# EAGLE design zeta2rework_lw_v5 (EAGLE 9.0.1)
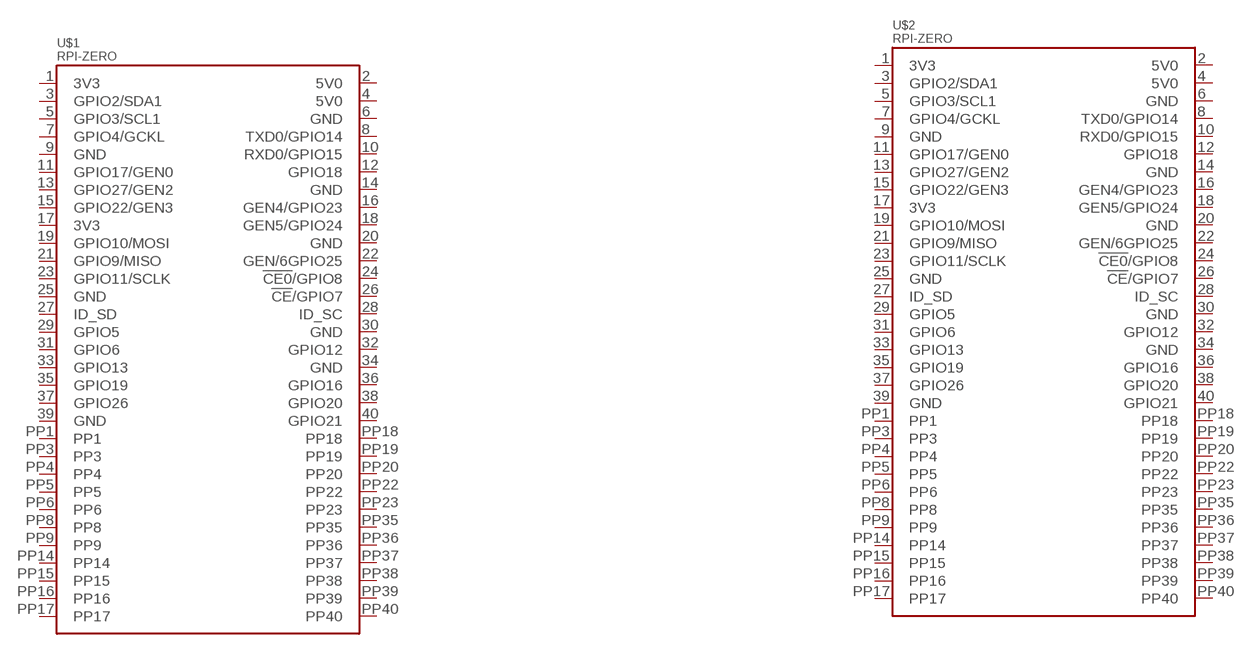
[diagram p0: schematic, sheet 1, part 1 of 2]
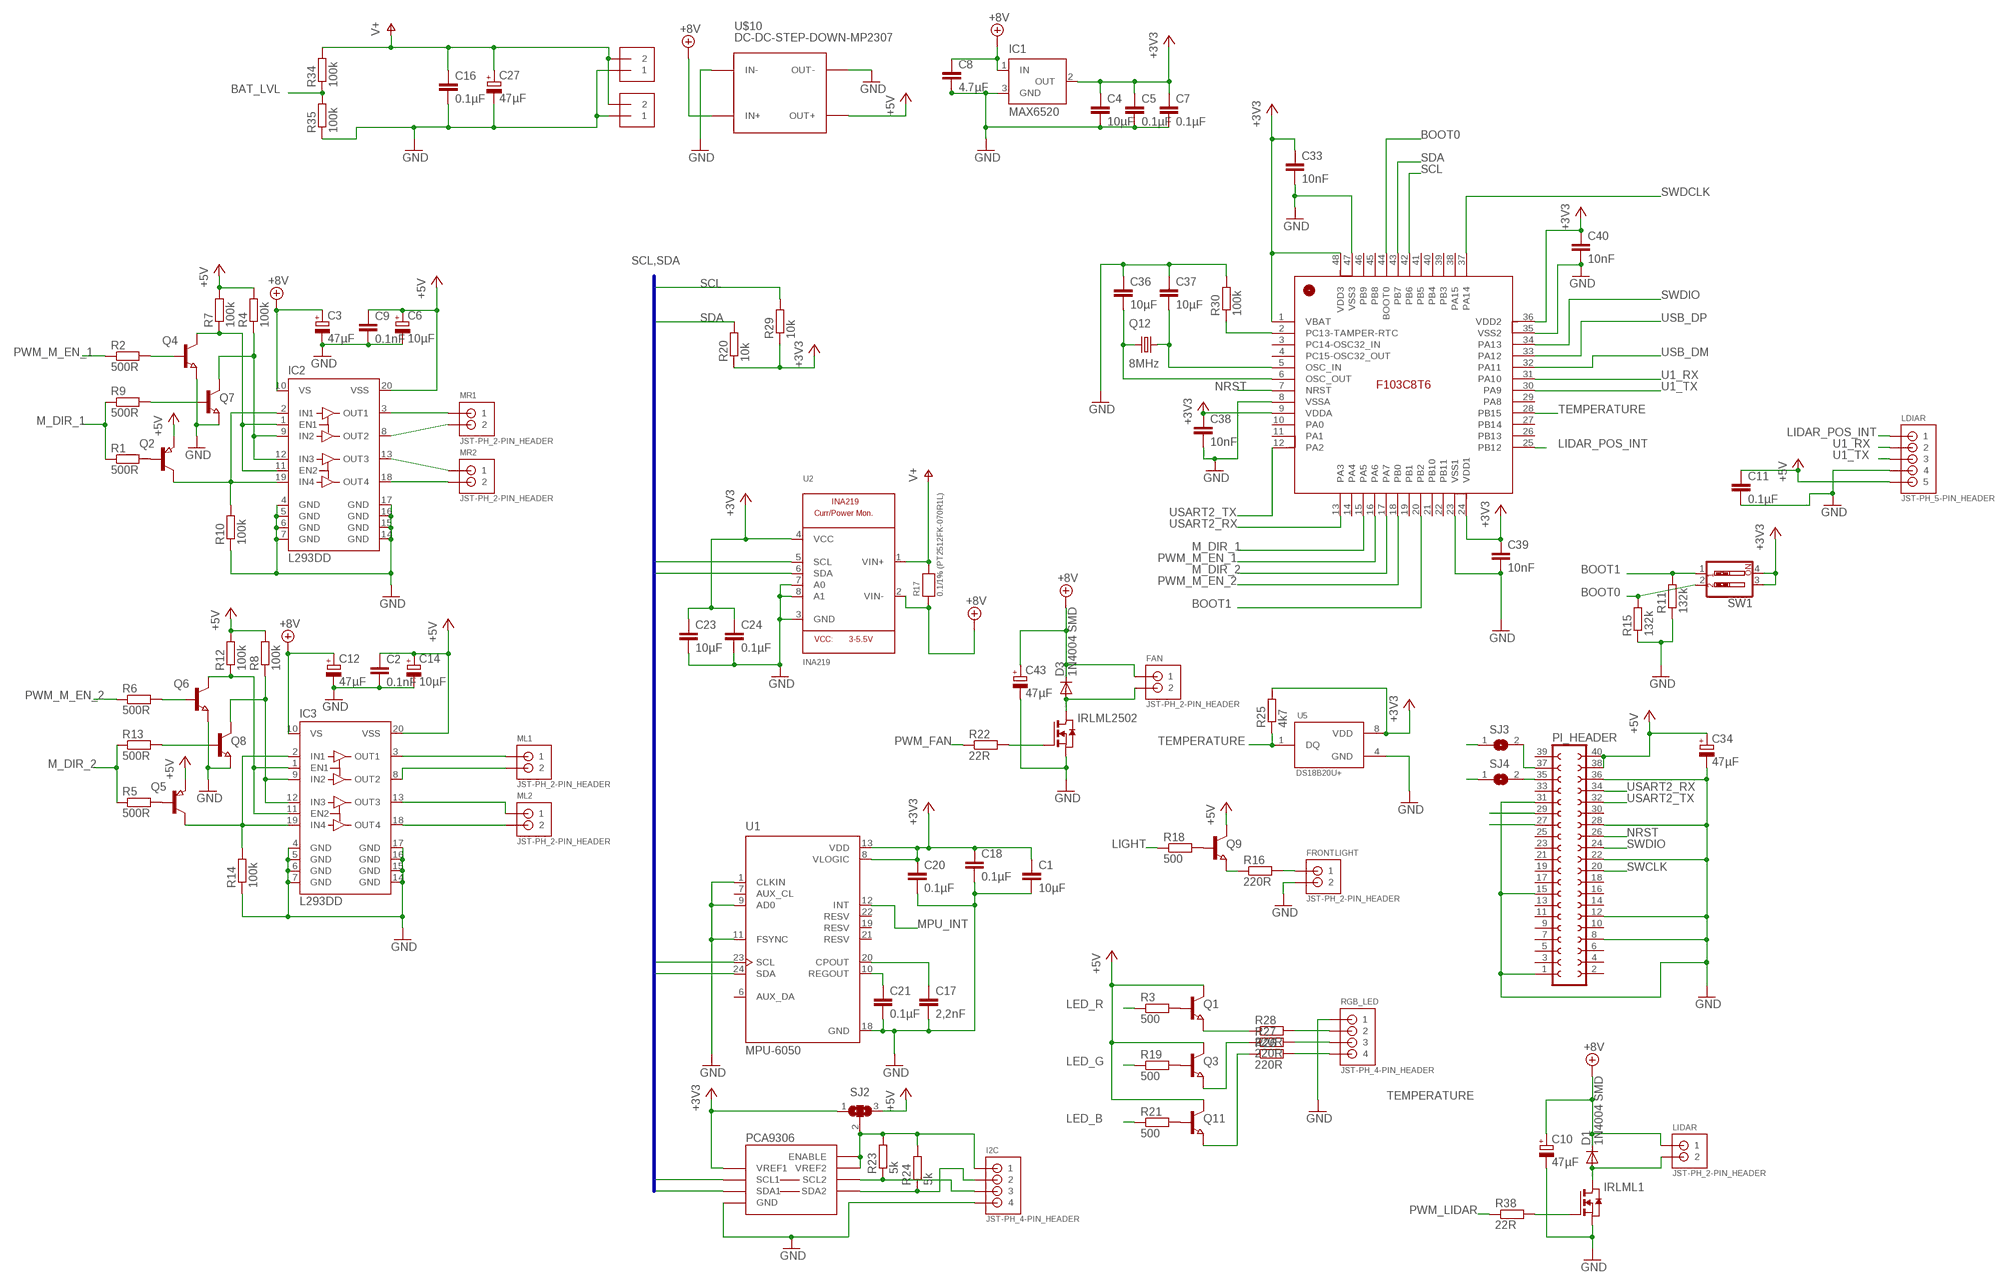
[diagram p1: schematic, sheet 1, part 2 of 2]

## Parts
C1  10µF  C-EUC1206  [C1206]
C2  0.1nF  C-EUC1206  [C1206]
C3  47µF  CPOL-EUUD-4X5,8  [UD-4X5,8_NICHICON]
C4  10µF  C-EUC1206  [C1206]
C5  0.1µF  C-EUC1206  [C1206]
C6  10µF  CPOL-EUUD-4X5,8  [UD-4X5,8_NICHICON]
C7  0.1µF  C-EUC1206  [C1206]
C8  4.7µF  C-EUC1206  [C1206]
C9  0.1nF  C-EUC1206  [C1206]
C10  47µF  CPOL-EUUD-4X5,8  [UD-4X5,8_NICHICON]
C11  0.1µF  C-EUC1206  [C1206]
C12  47µF  CPOL-EUUD-4X5,8  [UD-4X5,8_NICHICON]
C14  10µF  CPOL-EUUD-4X5,8  [UD-4X5,8_NICHICON]
C16  0.1µF  C-EUC1206  [C1206]
C17  2,2nF  C-EUC1206  [C1206]
C18  0.1µF  C-EUC1206  [C1206]
C20  0.1µF  C-EUC1206  [C1206]
C21  0.1µF  C-EUC1206  [C1206]
C23  10µF  C-EUC1206  [C1206]
C24  0.1µF  C-EUC1206  [C1206]
C27  47µF  CPOL-EUUD-4X5,8  [UD-4X5,8_NICHICON]
C33  10nF  C-EUC1206  [C1206]
C34  47µF  CPOL-EUUD-4X5,8  [UD-4X5,8_NICHICON]
C36  10µF  C-EUC1206  [C1206]
C37  10µF  C-EUC1206  [C1206]
C38  10nF  C-EUC1206  [C1206]
C39  10nF  C-EUC1206  [C1206]
C40  10nF  C-EUC1206  [C1206]
C43  47µF  CPOL-EUUD-4X5,8  [UD-4X5,8_NICHICON]
D1  1N4004 SMD  DIODE-DO214AC  [DO214AC]
D3  1N4004 SMD  DIODE-DO214AC  [DO214AC]
FAN  JST-PH_2-PIN_HEADER  [JST_B2B-PH_HEADER]
FRONTLIGHT  JST-PH_2-PIN_HEADER  [JST_B2B-PH_HEADER]
I2C  JST-PH_4-PIN_HEADER  [JST_B4B-PH_HEADER]
IC1  MAX6520  [SOT23]
IC2  L293DD  [SO20]
IC3  L293DD  [SO20]
IRLML1  NMOSSOT23  [SOT-23]
IRLML2502  NMOSSOT23  [SOT-23]
LDIAR  JST-PH_5-PIN_HEADER  [JST_B5B-PH_HEADER]
LIDAR  JST-PH_2-PIN_HEADER  [JST_B2B-PH_HEADER]
ML1  JST-PH_2-PIN_HEADER  [JST_B2B-PH_HEADER]
ML2  JST-PH_2-PIN_HEADER  [JST_B2B-PH_HEADER]
MR1  JST-PH_2-PIN_HEADER  [JST_B2B-PH_HEADER]
MR2  JST-PH_2-PIN_HEADER  [JST_B2B-PH_HEADER]
PCA9306  IC2_LEVEL_TRANSLATER  [SOIC-8]
PI_HEADER  FE20-2  [FE20-2]
Q1  NPN-TRANSISTOR_SOT23  [SOT23]
Q2  PNP-TRANSISTOR_SOT23  [SOT23]
Q3  NPN-TRANSISTOR_SOT23  [SOT23]
Q4  NPN-TRANSISTOR_SOT23  [SOT23]
Q5  PNP-TRANSISTOR_SOT23  [SOT23]
Q6  NPN-TRANSISTOR_SOT23  [SOT23]
Q7  NPN-TRANSISTOR_SOT23  [SOT23]
Q8  NPN-TRANSISTOR_SOT23  [SOT23]
Q9  NPN-TRANSISTOR_SOT23  [SOT23]
Q11  NPN-TRANSISTOR_SOT23  [SOT23]
Q12  8MHz  KX-13  [7.0X5.0]
R1  500R  R-EU_R0603  [R0603]
R2  500R  R-EU_R0603  [R0603]
R3  500  R-EU_R0603  [R0603]
R4  100k  R-EU_R0603  [R0603]
R5  500R  R-EU_R0603  [R0603]
R6  500R  R-EU_R0603  [R0603]
R7  100k  R-EU_R0603  [R0603]
R8  100k  R-EU_R0603  [R0603]
R9  500R  R-EU_R0603  [R0603]
R10  100k  R-EU_R0603  [R0603]
R11  132k  R-EU_R0603  [R0603]
R12  100k  R-EU_R0603  [R0603]
R13  500R  R-EU_R0603  [R0603]
R14  100k  R-EU_R0603  [R0603]
R15  132k  R-EU_R0603  [R0603]
R16  220R  R-EU_R0603  [R0603]
R17  0.1/1% (PT2512FK-070R1L)  RESISTOR2512  [2512]
R18  500  R-EU_R1206  [R1206]
R19  500  R-EU_R0603  [R0603]
R20  10k  R-EU_R0603  [R0603]
R21  500  R-EU_R0603  [R0603]
R22  22R  R-EU_R0603  [R0603]
R23  5k  R-EU_R0603  [R0603]
R24  5k  R-EU_R0603  [R0603]
R25  4k7  R-EU_R0603  [R0603]
R26  220R  R-EU_R0603  [R0603]
R27  220R  R-EU_R0603  [R0603]
R28  220R  R-EU_R0603  [R0603]
R29  10k  R-EU_R0603  [R0603]
R30  100k  R-EU_R0603  [R0603]
R34  100k  R-EU_R0603  [R0603]
R35  100k  R-EU_R0603  [R0603]
R38  22R  R-EU_R0603  [R0603]
RGB_LED  JST-PH_4-PIN_HEADER  [JST_B4B-PH_HEADER]
SJ2  SJ2W  [SJ_2]
SJ3  SOLDERJUMPERREFLOW_NOPASTE  [SOLDERJUMPER_REFLOW_NOPASTE]
SJ4  SOLDERJUMPERREFLOW_NOPASTE  [SOLDERJUMPER_REFLOW_NOPASTE]
STM32F103CB  STM32F103CB  STM32F103C8T6  [LQFP48_7X7MM_0.5MMPP]
SUPPLY_IN  TERMBLOCK_1X2-3.5MM  [1X2-3.5MM]
SUPPLY_IN1  TERMBLOCK_1X2-3.5MM  [1X2-3.5MM]
SW1  SW_DIP-2  [EDG-02]
U1  MPU-6050  [QFN50P400X400X95-24N]
U2  INA219  [SOT23-8]
U5  DS18B20U+  [SOP65P490X95-8N]
U$1  RPI-ZERO  [RASP_PI_ZERO_BOARD_FULL]
U$2  RPI-ZERO  [RASP_PI_ZERO_BOARD_FULL]
U$10  DC-DC-STEP-DOWN-MP2307  [DC-DC-STEP-DOWN-MP2307]

## Nets
+3V3: C1.1 C4.1 C5.1 C7.1 C18.1 C20.1 C23.1 C24.1 C33.1 C38.1 C39.1 C40.1 IC1.2(OUT) PCA9306.1(VREF1) R20.1 R25.2 R29.1 SJ2.1 STM32F103CB.1(VBAT) STM32F103CB.9(VDDA) STM32F103CB.24(VDD1) STM32F103CB.36(VDD2) STM32F103CB.48(VDD3) SW1.3 SW1.4 U1.8(VLOGIC) U1.13(VDD) U2.4(VCC) U5.8(VDD)
+5V: C2.1 C6.+ C9.1 C11.1 C14.+ C34.+ IC2.20(VSS) IC3.20(VSS) LDIAR.P5 PI_HEADER.38 PI_HEADER.40 Q1.3(C) Q2.2(E) Q3.3(C) Q5.2(E) Q9.3(C) Q11.3(C) R4.2 R7.2 R8.2 R12.2 SJ2.3 U$10.OUT+
+8V: C3.+ C8.1 C10.+ C12.+ C43.+ D1.C D3.C FAN.P1 IC1.1(IN) IC2.10(VS) IC3.10(VS) LIDAR.P1 R17.1 U2.2(VIN-) U$10.IN+
BAT_LVL: R34.1 R35.2
BOOT0: R15.2 STM32F103CB.44(BOOT0) SW1.2
BOOT1: R11.2 STM32F103CB.20(PB2) SW1.1
BOOT2: PI_HEADER.29
BOOT3: PI_HEADER.27
GND: C1.2 C2.2 C3.- C4.2 C5.2 C6.- C7.2 C8.2 C9.2 C10.- C11.2 C12.- C14.- C16.2 C17.2 C18.2 C20.2 C21.2 C23.2 C24.2 C27.- C33.2 C34.- C36.1 C37.1 C38.2 C39.2 C40.2 C43.- FRONTLIGHT.P2 I2C.P4 IC1.3(GND) IC2.4(GND) IC2.5(GND) IC2.6(GND) IC2.7(GND) IC2.14(GND) IC2.15(GND) IC2.16(GND) IC2.17(GND) IC3.4(GND) IC3.5(GND) IC3.6(GND) IC3.7(GND) IC3.14(GND) IC3.15(GND) IC3.16(GND) IC3.17(GND) IRLML1.2(S) IRLML2502.2(S) LDIAR.P4 PCA9306.4(GND) PI_HEADER.1 PI_HEADER.8 PI_HEADER.12 PI_HEADER.15 PI_HEADER.22 PI_HEADER.28 PI_HEADER.31 PI_HEADER.36 Q4.2(E) Q6.2(E) Q7.2(E) Q8.2(E) R10.1 R11.1 R14.1 R15.1 R30.2 R35.1 RGB_LED.P1 STM32F103CB.8(VSSA) STM32F103CB.23(VSS1) STM32F103CB.35(VSS2) STM32F103CB.47(VSS3) SUPPLY_IN1.1 SUPPLY_IN.1 U1.1(CLKIN) U1.9(AD0) U1.11(FSYNC) U1.18(GND) U2.3(GND) U2.7(A0) U2.8(A1) U5.4(GND) U$10.IN- U$10.OUT-
LED_B: R21.1
LED_G: R19.1
LED_R: R3.1
LIDAR_POS_INT: LDIAR.P1 STM32F103CB.25(PB12)
LIGHT: R18.1
M_DIR_1: R1.1 R9.1 STM32F103CB.15(PA5)
M_DIR_2: R5.1 R13.1 STM32F103CB.17(PA7)
MPU_INT: U1.12(INT)
N$1: IC2.9(IN2) IC2.12(IN3) Q7.3(C) R4.1
N$2: IC3.18(OUT4) ML2.P2
N$3: IC3.13(OUT3) ML2.P1
N$4: IC2.18(OUT4) MR2.P2
N$5: IC2.2(IN1) IC2.19(IN4) Q2.3(C) R10.2
N$6: IC3.9(IN2) IC3.12(IN3) Q8.3(C) R8.1
N$7: IC3.2(IN1) IC3.19(IN4) Q5.3(C) R14.2
N$8: IC2.1(EN1) IC2.11(EN2) Q4.3(C) R7.1
N$9: IC3.1(EN1) IC3.11(EN2) Q6.3(C) R12.1
N$10: Q2.1(B) R1.2
N$11: Q4.1(B) R2.2
N$12: Q7.1(B) R9.2
N$13: Q5.1(B) R5.2
N$14: Q6.1(B) R6.2
N$15: Q8.1(B) R13.2
N$16: IC2.13(OUT3) MR2.P1
N$17: IC2.8(OUT2) MR1.P2
N$18: IC2.3(OUT1) MR1.P1
N$19: Q9.1(B) R18.2
N$20: Q9.2(E) R16.1
N$21: FRONTLIGHT.P1 R16.2
N$22: Q1.1(B) R3.2
N$23: Q3.1(B) R19.2
N$24: Q1.2(E) R28.1
N$25: IC3.8(OUT2) ML1.P2
N$26: IC3.3(OUT1) ML1.P1
N$28: Q3.2(E) R27.1
N$30: Q11.2(E) R26.1
N$31: R26.2 RGB_LED.P4
N$32: Q11.1(B) R21.2
N$33: R27.2 RGB_LED.P3
N$34: C17.1 U1.20(CPOUT)
N$35: R28.2 RGB_LED.P2
N$36: C21.1 U1.10(REGOUT)
N$37: IRLML2502.3(G) R22.2
N$38: IRLML1.3(G) R38.2
N$39: D1.A IRLML1.1(D) LIDAR.P2
N$41: I2C.P1 PCA9306.7(VREF2) PCA9306.8(ENABLE) R23.2 R24.2 SJ2.2
N$42: I2C.P3 PCA9306.6(SCL2) R23.1
N$43: I2C.P2 PCA9306.5(SDA2) R24.1
N$44: PI_HEADER.37 SJ3.2
N$45: PI_HEADER.35 SJ4.2
N$46: C36.2 Q12.1 STM32F103CB.6(OSC_OUT)
N$47: C37.2 Q12.3 STM32F103CB.5(OSC_IN)
N$49: R30.1 STM32F103CB.2(PC13-TAMPER-RTC)
N$55: D3.A FAN.P2 IRLML2502.1(D)
NRST: PI_HEADER.26 STM32F103CB.7(NRST)
PWM_FAN: R22.1
PWM_LIDAR: R38.1
PWM_M_EN_1: R2.1 STM32F103CB.16(PA6)
PWM_M_EN_2: R6.1 STM32F103CB.18(PB0)
SCL: R29.2 STM32F103CB.42(PB6) U1.23(SCL) U2.5(SCL)
SCL2: PCA9306.2(SCL1)
SCL3: SJ4.1
SDA: R20.2 STM32F103CB.43(PB7) U1.24(SDA) U2.6(SDA)
SDA2: PCA9306.3(SDA1)
SDA3: SJ3.1
SWCLK: PI_HEADER.20
SWDCLK: STM32F103CB.37(PA14)
SWDIO: PI_HEADER.24 STM32F103CB.34(PA13)
TEMPERATURE: R25.1 STM32F103CB.28(PB15) U5.1(DQ)
U1_RX: LDIAR.P2 STM32F103CB.31(PA10)
U1_TX: LDIAR.P3 STM32F103CB.30(PA9)
USART2_RX: PI_HEADER.34 STM32F103CB.13(PA3)
USART2_TX: PI_HEADER.32 STM32F103CB.12(PA2)
USB_DM: STM32F103CB.32(PA11)
USB_DP: STM32F103CB.33(PA12)
V+: C16.1 C27.+ R17.2 R34.2 SUPPLY_IN1.2 SUPPLY_IN.2 U2.1(VIN+)
Unconnected: PI_HEADER.2 PI_HEADER.3 PI_HEADER.4 PI_HEADER.5 PI_HEADER.6 PI_HEADER.7 PI_HEADER.9 PI_HEADER.10 PI_HEADER.11 PI_HEADER.13 PI_HEADER.14 PI_HEADER.16 PI_HEADER.17 PI_HEADER.18 PI_HEADER.19 PI_HEADER.21 PI_HEADER.23 PI_HEADER.25 PI_HEADER.30 PI_HEADER.33 PI_HEADER.39 STM32F103CB.3(PC14-OSC32_IN) STM32F103CB.4(PC15-OSC32_OUT) STM32F103CB.10(PA0) STM32F103CB.11(PA1) STM32F103CB.14(PA4) STM32F103CB.19(PB1) STM32F103CB.21(PB10) STM32F103CB.22(PB11) STM32F103CB.26(PB13) STM32F103CB.27(PB14) STM32F103CB.29(PA8) STM32F103CB.38(PA15) STM32F103CB.39(PB3) STM32F103CB.40(PB4) STM32F103CB.41(PB5) STM32F103CB.45(PB8) STM32F103CB.46(PB9) U1.6(AUX_DA) U1.7(AUX_CL) U1.19(RESV) U1.21(RESV) U1.22(RESV) U$1.1(3V3) U$1.2(5V0) U$1.3(GPIO2/SDA1) U$1.4(5V0) U$1.5(GPIO3/SCL1) U$1.6(GND) U$1.7(GPIO4/GCKL) U$1.8(TXD0/GPIO14) U$1.9(GND) U$1.10(RXD0/GPIO15) U$1.11(GPIO17/GEN0) U$1.12(GPIO18) U$1.13(GPIO27/GEN2) U$1.14(GND) U$1.15(GPIO22/GEN3) U$1.16(GEN4/GPIO23) U$1.17(3V3) U$1.18(GEN5/GPIO24) U$1.19(GPIO10/MOSI) U$1.20(GND) U$1.21(GPIO9/MISO) U$1.22(GEN/6GPIO25) U$1.23(GPIO11/SCLK) U$1.24(!CE0!/GPIO8) U$1.25(GND) U$1.26(!CE!/GPIO7) U$1.27(ID_SD) U$1.28(ID_SC) U$1.29(GPIO5) U$1.30(GND) U$1.31(GPIO6) U$1.32(GPIO12) U$1.33(GPIO13) U$1.34(GND) U$1.35(GPIO19) U$1.36(GPIO16) U$1.37(GPIO26) U$1.38(GPIO20) U$1.39(GND) U$1.40(GPIO21) U$1.PP1 U$1.PP3 U$1.PP4 U$1.PP5 U$1.PP6 U$1.PP8 U$1.PP9 U$1.PP14 U$1.PP15 U$1.PP16 U$1.PP17 U$1.PP18 U$1.PP19 U$1.PP20 U$1.PP22 U$1.PP23 U$1.PP35 U$1.PP36 U$1.PP37 U$1.PP38 U$1.PP39 U$1.PP40 U$2.1(3V3) U$2.2(5V0) U$2.3(GPIO2/SDA1) U$2.4(5V0) U$2.5(GPIO3/SCL1) U$2.6(GND) U$2.7(GPIO4/GCKL) U$2.8(TXD0/GPIO14) U$2.9(GND) U$2.10(RXD0/GPIO15) U$2.11(GPIO17/GEN0) U$2.12(GPIO18) U$2.13(GPIO27/GEN2) U$2.14(GND) U$2.15(GPIO22/GEN3) U$2.16(GEN4/GPIO23) U$2.17(3V3) U$2.18(GEN5/GPIO24) U$2.19(GPIO10/MOSI) U$2.20(GND) U$2.21(GPIO9/MISO) U$2.22(GEN/6GPIO25) U$2.23(GPIO11/SCLK) U$2.24(!CE0!/GPIO8) U$2.25(GND) U$2.26(!CE!/GPIO7) U$2.27(ID_SD) U$2.28(ID_SC) U$2.29(GPIO5) U$2.30(GND) U$2.31(GPIO6) U$2.32(GPIO12) U$2.33(GPIO13) U$2.34(GND) U$2.35(GPIO19) U$2.36(GPIO16) U$2.37(GPIO26) U$2.38(GPIO20) U$2.39(GND) U$2.40(GPIO21) U$2.PP1 U$2.PP3 U$2.PP4 U$2.PP5 U$2.PP6 U$2.PP8 U$2.PP9 U$2.PP14 U$2.PP15 U$2.PP16 U$2.PP17 U$2.PP18 U$2.PP19 U$2.PP20 U$2.PP22 U$2.PP23 U$2.PP35 U$2.PP36 U$2.PP37 U$2.PP38 U$2.PP39 U$2.PP40

## Buses
SCL,SDA

## Library data of the parts
C1 C2 C4 C5 C7-C9 C11 C16-C18 C20 C21 C23 C24 C33 C36-C40 = rcl:C-EU: CAPACITOR, European symbol; SPICEPREFIX: C
C3 C6 C10 C12 C14 C27 C34 C43 = rcl:CPOL-EU: POLARIZED CAPACITOR, European symbol; SPICEPREFIX: C
D1 D3 = diode:DIODE-: DIODE
FAN FRONTLIGHT LIDAR ML1 ML2 MR1 MR2 = srg:JST-PH_2-PIN_HEADER: 2-pin JST PH Shrouded Header, top entry P/N B2B-PH-K-S Mating connector PHR-2 Mating cable assembly: Sparkfun PRT-09914 <http://www.sparkfun.com/products/9914>
I2C RGB_LED = srg:JST-PH_4-PIN_HEADER: 4-pin JST PH Shrouded Header, top entry P/N B4B-PH-K-S Mating connector PHR-4 Mating cable assembly: Sparkfun PRT-09916 <http://www.sparkfun.com/products/9916>
IC1 = maxim:MAX6520: 1.2V Voltage Reference 50ppm/°C, SOT23, 3-Terminal Source: Data sheet <http://datasheets.maxim-ic.com/en/ds/MAX6520.pdf>; MF: MAXIM; MPN: MAX6520EUR-T; OC_FARNELL: unknown; OC_NEWARK: 02J4586
IC2 IC3 = st-microelectronics:L293DD: PUSH-PULL FOUR CHANNEL DRIVER WITH DIODES Source: http://www.st.com/stonline/books/pdf/docs/1330.pdf; OC_FARNELL: unknown
IRLML1 IRLML2502 = zetex:NMOSSOT23: MOS FET; OC_FARNELL: unknown; OC_NEWARK: unknown
LDIAR = srg:JST-PH_5-PIN_HEADER: 5-pin JST PH Shrouded Header, top entry P/N B5B-PH-K-S Mating connector PHR-5 Mating cable assembly: Sparkfun PRT-09917 <http://www.sparkfun.com/products/9917>
PCA9306 = srg:IC2_LEVEL_TRANSLATER: I2C Level Translator PCA9306 Data Sheet <http://www.ti.com/lit/ds/symlink/pca9306.pdf> Sparkfun breakout board schematic <http://dlnmh9ip6v2uc.cloudfront.net/datasheets/BreakoutBoards/PCA9306_Breakout.pdf>
PI_HEADER = con-lsta:FE20-2: FEMALE HEADER; OC_FARNELL: unknown; OC_NEWARK: unknown
Q1 Q3 Q4 Q6-Q9 Q11 = semicon-smd-ipc:NPN-TRANSISTOR_: NPN TRANSISTOR
Q2 Q5 = semicon-smd-ipc:PNP-TRANSISTOR_: PNP TRANSISTOR
Q12 = crystal-geyer_V1_0:KX: Quartz Crystals (MHz) SMD: KX - Serie Model Size l/w/h [mm] Frequency Range Frequency Stability Temp. Range [°C] Load Capacitance AECQ 200 availabel Datasheet KX-4 KX-5 KX-6 KX-7 KX-9A KX-9B KX-12A KX-12B KX-13 KX-20 KX-K KX-KS 1.6/1.2/0.3 2.0/1.6/0.45 2.5/2.0/0.55 3.2/2.5/0.8 5.0/3.2/1.0 5.0/3.2/1.1 6.0/3.5/1.1 6.0/3.5/1.0 7.0/5.0 /1.3 11.6/5.5/1.6 12.3/4.5/4.2 12.3/4.5/3.2 24.0 ~ 80.0 MHz 16.0 ~ 80.0 MHz 12.0 ~ 80.0 MHz 8.0 ~ 60.0 MHz 7,68 ~ 300,0 MHz 8,0 ~ 50,0 MHz 8,0 ~ 150,0 MHz 8,0 ~ 50,0 MHz 6,0 ~ 160,0 MHz 3,579 ~ 25,0 MHz 3,579 ~ 70,0 MHz 3,579 ~ 70,0 MHz ±10 … ±50ppm ±10 … ±50ppm ±10 … ±50ppm ±10 … ±50ppm ±10 … ±50ppm ±10 … ±50ppm ±10 … ±50ppm ±10 … ±50ppm ±10 … ±50ppm ±50ppm ±10 … ±50ppm ±10 … ±50ppm (*) -40°C …+85°C (*) -40°C …+125°C (*) -40°C …+125°C (*) -40°C …+125°C (*) -40°C …+105°C (*) -40°C …+105°C (*) -40°C …+125°C (*) -40°C …+105°C (*) -40°C …+105°C (*) -40°C …+105°C (*) -40°C …+85°C (*) -40°C …+85°C 8, 8…16 8, 8…16 10, 8…16 12, 7…20 16, 10…20 16, 10…20 16, 10…20 16, 12…20 16, 12…20 16, 12…20 16, 12…30 16, 12…30 - yes yes yes - - - - - - - - KX-4.pdf <http://www.geyer-electronic.de/uploads/tx_userartikelfrequenz/GEYER-KX-4.pdf> KX-5.pdf <http://www.geyer-electronic.de/uploads/tx_userartikelfrequenz/GEYER-KX-5.pdf> KX-6.pdf <http://www.geyer-electronic.de/uploads/tx_userartikelfrequenz/GEYER-KX-6.pdf> KX-7.pdf <http://www.geyer-electronic.de/uploads/tx_userartikelfrequenz/GEYER-KX-7.pdf> KX-9A.pdf <http://www.geyer-electronic.de/uploads/tx_userartikelfrequenz/GEYER-KX-9A.pdf> KX-9B.pdf <http://www.geyer-electronic.de/uploads/tx_userartikelfrequenz/GEYER-KX-9B.pdf> KX-12A.pdf <http://www.geyer-electronic.de/uploads/tx_userartikelfrequenz/GEYER-KX-12A.pdf> KX-12B.pdf <http://www.geyer-electronic.de/uploads/tx_userartikelfrequenz/GEYER-KX-12B.pdf> KX-13.pdf <http://www.geyer-electronic.de/uploads/tx_userartikelfrequenz/GEYER-KX-13.pdf> KX-20.pdf <http://www.geyer-electronic.de/uploads/tx_userartikelfrequenz/GEYER-KX-20.pdf> KX-K.pdf <http://www.geyer-electronic.de/uploads/tx_userartikelfrequenz/GEYER-KX-K.pdf> KX-KS.pdf <http://www.geyer-electronic.de/uploads/tx_userartikelfrequenz/GEYER-KX-KS.pdf> <http://www.geyer-electronic.de/fileadmin/template/img/logo-geyer-electronic.png> Details see: http://www.geyer-electronic.de/Frequenz-Produkte.9.0.html Created 2016-06-07, Hans Locher 2016 (C) Geyer Quartz Technology KX4,KX5,KX6,KX7,KX9A,KX9B,KX12A,KX12B,KX13,KX20,KXK,KXKS;1612;2016;2520;3225;5032;6035;7050;11655;12345;1,6x1,2;2,0x1,6;2,5x2,0;3,2x2,5;5,0x3,2;6,0x3,5;7,0x5,0;11,6x5,5;12,3x4,5;12,3x4,5;1.6x1.2;2.0x1.6;2.5x2.0;3.2x2.5;5.0x3.2;6.0x3.5;7.0x5.0;11.6x5.5;12.3x4.5;12.3x4.5;
R1-R16 R18-R30 R34 R35 R38 = rcl:R-EU_: RESISTOR, European symbol; SPICEPREFIX: R
R17 = microbuilder:RESISTOR: Resistors 0402 - 0402 Surface Mount Package 22 Ohm 1% 1/16W [Digikey: 311-22.0LRTR-ND] 33 Ohm 5% 1/16W 1.0K 5% 1/16W 1.5K 5% 1/16W 2.0K 1% 1/16W 10.0K 1% 1/16W [Digikey: 311-10.0KLRTR-ND] 10.0K 5% 1/16W [Digikey: RMCF0402JT10K0TR-ND] 12.1K 1% 1/16W [Digikey: 311-22.0LRTR-ND] 100.0K 5% 1/16W 0603 - 0603 Surface Mount Package 0 Ohm 1/10 Watt 1% Resistor 15 Ohm 1/10 Watt 1% Resistor 33 Ohm 1/10 Watt 1% Resistor 49.9 Ohm 1/10 Watt 1% Resistor 100 Ohm 1/10 Watt 1% Resistor 150 Ohm 1/10 Watt 1% Resistor 240 Ohm 1/10 Watt 1% Resistor 390 Ohm 1/10 Watt 1% Resistor 560 Ohm 1/10 Watt 1% Resistor 680 Ohm 1/10 Watt 1% Resistor 750 Ohm 1/10 Watt 1% Resistor 1.0K Ohm 1/10 Watt 1% Resistor 1.5K Ohm 1/10 Watt 1% Resistor 2.0K Ohm 1/10 Watt 1% Resistor 2.2K Ohm 1/10 Watt 1% Resistor 3.3K Ohm 1/10 Watt 1% Resistor 4.7K Ohm 1/10 Watt 1% Resistor 10.0K Ohm 1/10 Watt 1% Resistor 12.0K Ohm 1/10 Watt 1% Resistor 12.1K Ohm 1/10 Watt 1% Resistor 20.0K Ohm 1/10 Watt 1% Resistor 33.0K Ohm 1/10 Watt 1% Resistor 100.0K Ohm 1/10 Watt 1% Resistor 0805 - 0805 Surface Mount Package 0 Ohm 1/8 Watt 1% Resistor 33 Ohm 1/8 Watt 1% Resistor 100 Ohm 1/8 Watt 1% Resistor 150 Ohm 1/8 Watt 1% Resistor 200 Ohm 1/8 Watt 1% Resistor 240 Ohm 1/8 Watt 1% Resistor 330 Ohm 1/8 Watt 1% Resistor 390 Ohm 1/8 Watt 1% Resistor 470 Ohm 1/8 Watt 1% Resistor 1.0K Ohm 1/8 Watt 1% Resistor 1.5K Ohm 1/8 Watt 1% Resistor 2.0K Ohm 1/8 Watt 1% Resistor 4.7K Ohm 1/8 Watt 1% Resistor 5.1K Ohm 1/8 Watt 1% Resistor 5.6K Ohm 1/8 Watt 1% Resistor 10.0K Ohm 1/8 Watt 1% Resistor 22.0K Ohm 1/8 Watt 1% Resistor 33.0K Ohm 1/8 Watt 1% Resistor 100K Ohm 1/8 Watt 1% Resistor 1206 - 1206 Surface Mount Package 2012 - 2010 Surface Mount Package 0.11 Ohm 1/2 Watt 1% Resistor - Digikey: RHM.11UCT-ND
SJ2 = jumper:SJ2W: SMD solder JUMPER
SJ3 SJ4 = microbuilder:SOLDERJUMPER: SMD Solder JUMPER Solder the two pads together to create a connection, or remove the solder to break it. REFLOW - Use this footprint for solder paste and reflow ovens. WAVE - Use this footprint for hand-soldering (larger pads). CLOSED - Has a trace between the two pads to ensure it is closed by default. The trace needs to be cut to disable the jumper, and can be closed again by creating a solder bridge between the two pads.
STM32F103CB = STM32F103C8T6:STM32F103C8T6; AVAILABILITY: Good; DESCRIPTION: Mainstream Performance line, ARM Cortex-M3 MCU with 64 Kbytes Flash, 72 MHz CPU, motor control, USB and CAN; MF: STMicroelectronics; MP: STM32F103C8T6; PACKAGE: LQFP-48 STMicroelectronics; PRICE: 3.83 USD
SUPPLY_IN SUPPLY_IN1 = microbuilder:TERMBLOCK_1X2: 3.5mm Terminal block http://www.ladyada.net/library/pcb/eaglelibrary.html
SW1 = special:SW_DIP-2: DIP SWITCH
U1 = MPU-6050:MPU-6050: MPU-6050 Six-Axis (Gyro + Accelerometer) MEMS MotionTracking™ Devices; AVAILABILITY: Good; DESCRIPTION: 3-axis gyroscope, 3-axis accelerometer in a 4x4x0.9 housing; MF: TDK; MP: MPU-6050; PACKAGE: QFN-24 InvenSense; PRICE: 5.12 USD
U2 = INA219:INA219: INA219 - I2C Current/Power Monitor Voltage Range: 0-26V Accuracy: 0.5% Temperature: -40°C - 125°C; AVAILABILITY: Unavailable; DESCRIPTION: the ina219 is a high-side current shunt and power monitor with an i2c interface. the ina219 monitors both shunt drop ...; MF: Texas Instruments; MP: INA219; PACKAGE: None; PRICE: None
U5 = DS18B20U_:DS18B20U+: Board Mount Temperature Sensors Prgmble Resolution 1-Wire Parasite Pwr; AVAILABILITY: Unavailable; DESCRIPTION: Date Code: 1043+; RoHS Compliant: Yes;; MF: Maxim; MP: DS18B20U+; PACKAGE: TSSOP-8 Chip Coolers; PRICE: None
U$1 U$2 = rpi-zero:RPI-ZERO
U$10 = diy-modules:DC-DC-STEP-DOWN-MP2307: DC/DC Step-Down Regulator based on MP2307DN chip MP2307 datasheet available here: https://cdn-shop.adafruit.com/datasheets/MP2307_r1.9.pdf Click here to find device on ebay.com <http://www.ebay.com/sch/dc+dc+3a+mini+converter>

## Board
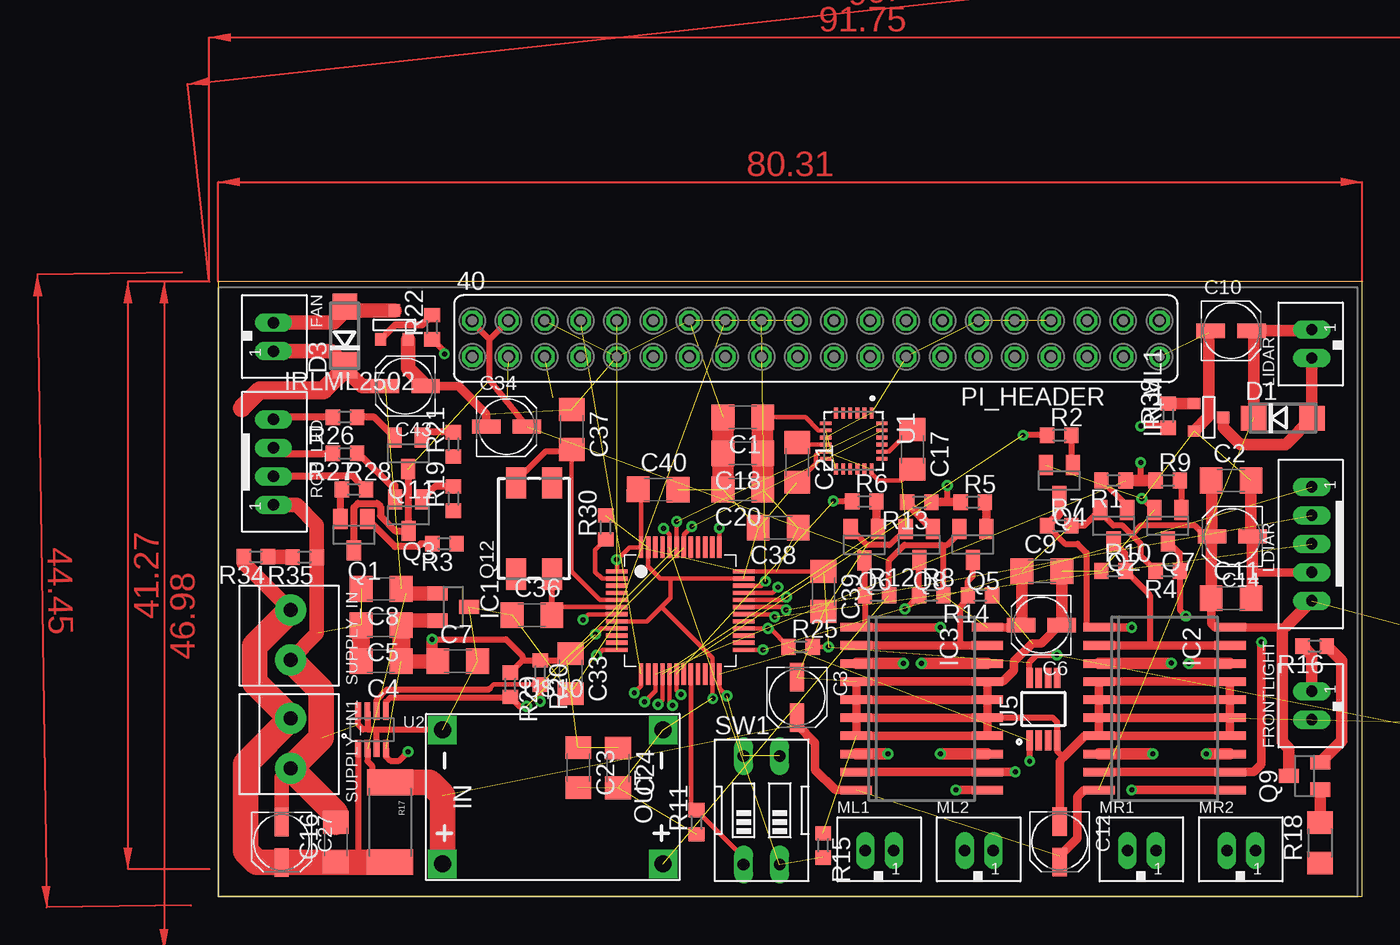
[diagram p2: board, top side]
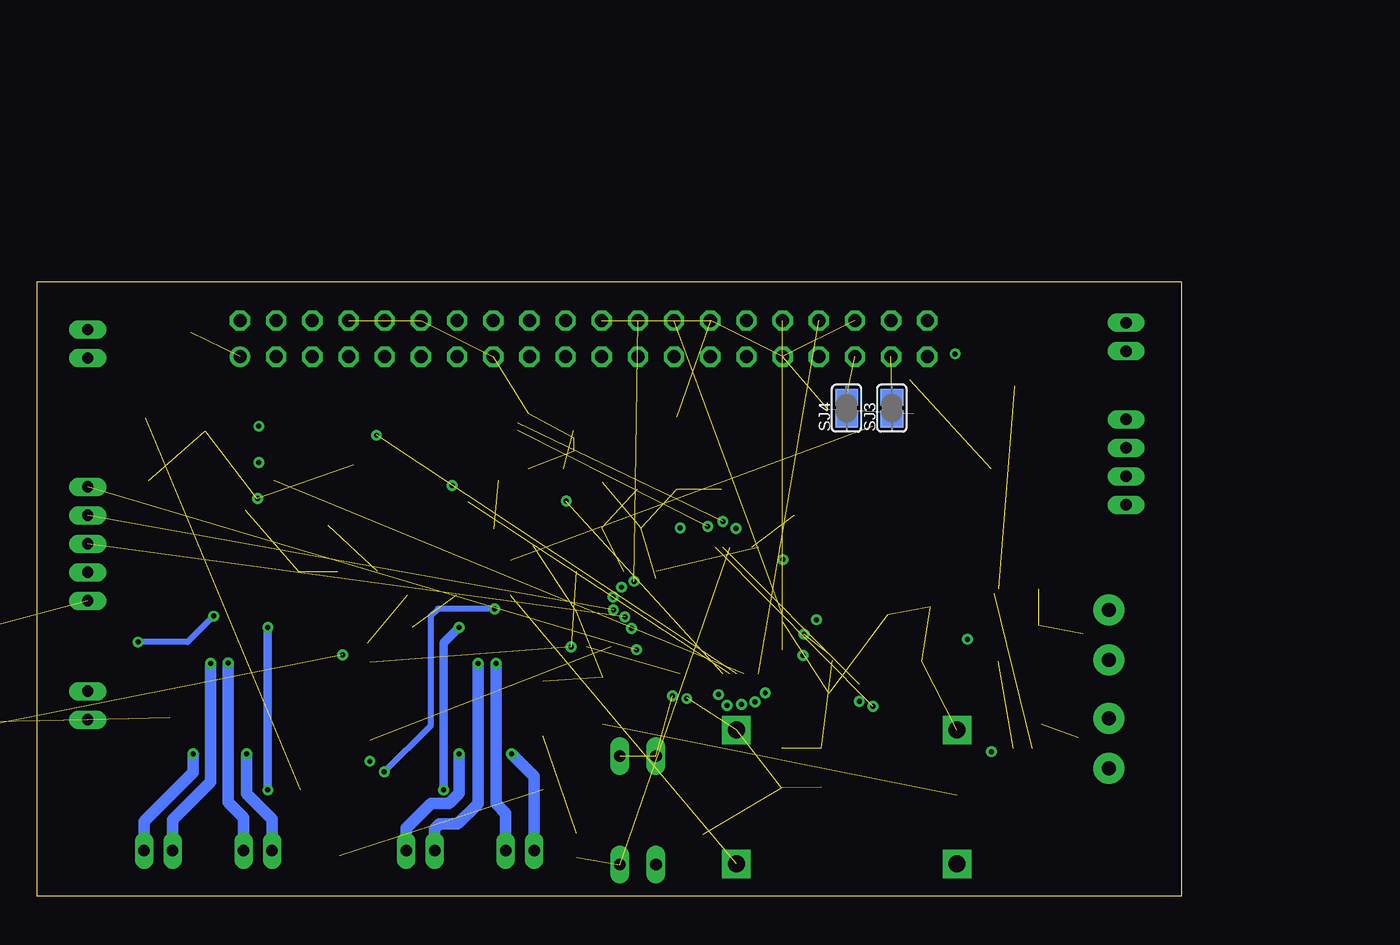
[diagram p3: board, bottom side, seen from below]

Size 80.31 x 43.17 mm. Coordinates in mm from the lower left corner, seen from the top.
Outline: 0,0 80.31,0 80.31,43.17 0,43.17 0,0
Copper layers (1*16): Top 0.035mm / dielectric 1.5mm / Bottom 0.035mm
Design rules "default": minimum track width 6mil, minimum drill 0.35mm, track to track 6mil, track to pad 6mil, pad to pad 6mil, via to via 6mil, smd to smd 6mil, copper to edge 40mil, drill to drill 6mil, minimum pad ring 10mil, minimum via ring 8mil, stop-mask expansion 4mil, vias tented up to drill 0mil, thermal gap 10mil

### Footprints (pad centres in the part's own frame; a part is rotated, then mirrored left to right if it is on the bottom)
C1206 = smd 1.6 x 1.8: 1 -1.4,0; 2 1.4,0
UD-4X5,8_NICHICON = smd 2 x 1: + 1.425,0; - -1.425,0
DO214AC = smd 1.8 x 1.7: A 2.05,0; C -2.05,0
JST_B2B-PH_HEADER = drill 0.8 long: P1 1.075,0.048; P2 -0.925,0.048
JST_B4B-PH_HEADER = drill 0.8 long: P1 2.98,0.048; P2 0.98,0.048; P3 -1.02,0.048; P4 -3.02,0.048
SOT23 = smd 1 x 1.4: 1 -0.95,-1.1; 2 0.95,-1.1; 3 0,1.1
SO20 = smd 0.6 x 2.2: 1 -5.715,-4.6; 2 -4.445,-4.6; 3 -3.175,-4.6; 4 -1.905,-4.6; 5 -0.635,-4.6; 6 0.635,-4.6; 7 1.905,-4.6; 8 3.175,-4.6; 9 4.445,-4.6; 10 5.715,-4.6; 11 5.715,4.6; 12 4.445,4.6; 13 3.175,4.6; 14 1.905,4.6; 15 0.635,4.6; 16 -0.635,4.6; 17 -1.905,4.6; 18 -3.175,4.6; 19 -4.445,4.6; 20 -5.715,4.6
SOT-23 = smd 0.787 x 0.889: 1 0.025,-1.016; 2 -0.94,1.016; 3 0.991,1.016
JST_B5B-PH_HEADER = drill 0.8 long: P1 4,0.048; P2 2,0.048; P3 0,0.048; P4 -2,0.048; P5 -4,0.048
SOIC-8 = smd 0.66 x 2.032: 1 -1.905,-3.073; 2 -0.635,-3.073; 3 0.635,-3.073; 4 1.905,-3.073; 5 1.905,3.073; 6 0.635,3.073; 7 -0.635,3.073; 8 -1.905,3.073
FE20-2 = drill 0.914: 1 -24.13,1.27 | drill 0.914 octagon: 2 -24.13,-1.27; 3 -21.59,1.27; 4 -21.59,-1.27; 5 -19.05,1.27; 6 -19.05,-1.27; 7 -16.51,1.27; 8 -16.51,-1.27; 9 -13.97,1.27; 10 -13.97,-1.27; 11 -11.43,1.27; 12 -11.43,-1.27; 13 -8.89,1.27; 14 -8.89,-1.27; 15 -6.35,1.27; 16 -6.35,-1.27; 17 -3.81,1.27; 18 -3.81,-1.27; 19 -1.27,1.27; 20 -1.27,-1.27; 21 1.27,1.27; 22 1.27,-1.27; 23 3.81,1.27; 24 3.81,-1.27; 25 6.35,1.27; 26 6.35,-1.27; 27 8.89,1.27; 28 8.89,-1.27; 29 11.43,1.27; 30 11.43,-1.27; 31 13.97,1.27; 32 13.97,-1.27; 33 16.51,1.27; 34 16.51,-1.27; 35 19.05,1.27; 36 19.05,-1.27; 37 21.59,1.27; 38 21.59,-1.27; 39 24.13,1.27; 40 24.13,-1.27
7.0X5.0 = smd 2.2 x 1.4: 1 -3.2,-1.25; 2 3.2,-1.25; 3 3.2,1.25; 4 -3.2,1.25
R0603 = smd 1 x 1.1: 1 -0.85,0; 2 0.85,0
2512 = smd 1.8 x 3.2: 1 -2.8,0; 2 2.8,0
R1206 = smd 1.6 x 1.803: 1 -1.422,0; 2 1.422,0
SJ_2 = smd 1.168 x 1.6: 1 -1.524,0; 2 0,0; 3 1.524,0
SOLDERJUMPER_REFLOW_NOPASTE = smd 1.168 x 1.6: 1 -0.762,0; 2 0.762,0
LQFP48_7X7MM_0.5MMPP = smd 1.5 x 0.3: 1 -4.45,2.75; 2 -4.45,2.25; 3 -4.45,1.75; 4 -4.45,1.25; 5 -4.45,0.75; 6 -4.45,0.25; 7 -4.45,-0.25; 8 -4.45,-0.75; 9 -4.45,-1.25; 10 -4.45,-1.75; 11 -4.45,-2.25; 12 -4.45,-2.75; 25 4.45,-2.75; 26 4.45,-2.25; 27 4.45,-1.75; 28 4.45,-1.25; 29 4.45,-0.75; 30 4.45,-0.25; 31 4.45,0.25; 32 4.45,0.75; 33 4.45,1.25; 34 4.45,1.75; 35 4.45,2.25; 36 4.45,2.75 | smd 0.3 x 1.5: 13 -2.75,-4.45; 14 -2.25,-4.45; 15 -1.75,-4.45; 16 -1.25,-4.45; 17 -0.75,-4.45; 18 -0.25,-4.45; 19 0.25,-4.45; 20 0.75,-4.45; 21 1.25,-4.45; 22 1.75,-4.45; 23 2.25,-4.45; 24 2.75,-4.45; 37 2.75,4.45; 38 2.25,4.45; 39 1.75,4.45; 40 1.25,4.45; 41 0.75,4.45; 42 0.25,4.45; 43 -0.25,4.45; 44 -0.75,4.45; 45 -1.25,4.45; 46 -1.75,4.45; 47 -2.25,4.45; 48 -2.75,4.45
1X2-3.5MM = drill 1 pad 2.184: 1 1.8,0; 2 -1.7,0
EDG-02 = drill 0.813 long: 1 -1.27,-3.81; 2 1.27,-3.81; 3 1.27,3.81; 4 -1.27,3.81
QFN50P400X400X95-24N = smd 0.79 x 0.26: 1 -1.97,1.25; 2 -1.97,0.75; 3 -1.97,0.25; 4 -1.97,-0.25; 5 -1.97,-0.75; 6 -1.97,-1.25; 13 1.97,-1.25; 14 1.97,-0.75; 15 1.97,-0.25; 16 1.97,0.25; 17 1.97,0.75; 18 1.97,1.25 | smd 0.26 x 0.79: 7 -1.25,-1.97; 8 -0.75,-1.97; 9 -0.25,-1.97; 10 0.25,-1.97; 11 0.75,-1.97; 12 1.25,-1.97; 19 1.25,1.97; 20 0.75,1.97; 21 0.25,1.97; 22 -0.25,1.97; 23 -0.75,1.97; 24 -1.25,1.97
SOT23-8 = smd 0.4 x 1.2: 1 -0.975,-1.3; 2 -0.325,-1.3; 3 0.325,-1.3; 4 0.975,-1.3; 5 0.975,1.3; 6 0.325,1.3; 7 -0.325,1.3; 8 -0.975,1.3
SOP65P490X95-8N = smd 1.4 x 0.45: 1 -2.2,0.975; 2 -2.2,0.325; 3 -2.2,-0.325; 4 -2.2,-0.975; 5 2.2,-0.975; 6 2.2,-0.325; 7 2.2,0.325; 8 2.2,0.975
RASP_PI_ZERO_BOARD_FULL = drill 1 pad 1.778 square: 1 8.37,25.23 | drill 1 pad 1.778: 2 8.37,27.77; 3 10.91,25.23; 4 10.91,27.77; 5 13.45,25.23; 6 13.45,27.77; 7 15.99,25.23; 8 15.99,27.77; 9 18.53,25.23; 10 18.53,27.77; 11 21.07,25.23; 12 21.07,27.77; 13 23.61,25.23; 14 23.61,27.77; 15 26.15,25.23; 16 26.15,27.77; 17 28.69,25.23; 18 28.69,27.77; 19 31.23,25.23; 20 31.23,27.77; 21 33.77,25.23; 22 33.77,27.77; 23 36.31,25.23; 24 36.31,27.77; 25 38.85,25.23; 26 38.85,27.77; 27 41.39,25.23; 28 41.39,27.77; 29 43.93,25.23; 30 43.93,27.77; 31 46.47,25.23; 32 46.47,27.77; 33 49.01,25.23; 34 49.01,27.77; 35 51.55,25.23; 36 51.55,27.77; 37 54.09,25.23; 38 54.09,27.77; 39 56.63,25.23; 40 56.63,27.77 | drill 0.8 pad 1.778: PP1 10.699,4.832; PP3 7.593,8.858; PP4 7.133,14.38; PP5 55.796,23.124; PP6 10.699,2.301; PP8 5.177,8.858; PP9 9.549,14.38; PP14 58.327,18.407; PP15 55.796,14.265; PP16 55.796,20.363; PP17 58.212,21.743; PP18 55.796,17.027; PP19 58.327,15.186; PP20 56.832,9.434; PP35 17.257,2.416; PP36 60.628,12.425; PP37 56.026,2.071; PP38 53.726,2.416; PP39 58.097,12.54; PP40 18.867,6.212 | drill 0.8 pad 1.422: PP22 23.009,2.071; PP23 24.734,2.071 | hole 2.75: 3.5,3.5; 3.5,26.5; 61.5,3.5; 61.5,26.5
DC-DC-STEP-DOWN-MP2307 = drill 1.2 pad 2 square: IN+ -7.747,-4.699; IN- -7.747,4.699; OUT+ 7.747,-4.699; OUT- 7.747,4.699

### Placement (x,y rotation side)
C1  36.83,33.65 180 top
C2  71.12,29.21 0 top
C3  40.64,13.97 270 top
C4  11.43,16.51 180 top
C5  11.43,19.05 180 top
C6  57.78,19.05 180 top
C7  16.81,16.51 0 top
C8  11.43,21.59 180 top
C9  57.84,22.83 0 top
C10  71.12,39.73 0 top
C11  71.12,20.95 0 top
C12  59.08,3.84 270 top
C14  71.2,25.27 180 top
C16  8.26,3.81 90 top
C17  48.74,31.39 270 top
C18  36.83,31.11 180 top
C20  36.83,28.57 180 top
C21  40.64,30.48 270 top
C23  25.27,9.04 270 top
C24  28.07,9.02 270 top
C27  4.45,3.81 270 top
C33  24.74,15.65 270 top
C34  20.24,32.99 0 top
C36  22.02,19.76 0 top
C37  24.82,32.79 270 top
C38  39.32,25.88 180 top
C39  42.49,21.41 270 top
C40  30.89,28.57 359.8 top
C43  13.13,35.84 180 top
D1  74.75,33.58 0 top
D3  8.89,39.37 90 top
FAN  3.81,39.37 270 top
FRONTLIGHT  76.83,13.33 90 top
I2C  108,-3.51 0 top  (outside the outline)
IC1  16.51,20.32 270 top
IC2  66.45,13.18 270 top
IC3  49.4,13.18 270 top
IRLML1  69.55,33.63 90 top
IRLML2502  12.4,40.13 180 top
LDIAR  76.83,24.77 90 top
LIDAR  76.83,38.73 90 top
ML1  46.35,3.17 0 top
ML2  53.34,3.17 0 top
MR1  64.77,3.17 0 top
MR2  71.75,3.17 0 top
PCA9306  100.79,9.93 90 top  (outside the outline)
PI_HEADER  41.96,39.17 180 top
Q1  9.53,25.4 180 top
Q2  62.87,26.03 180 top
Q3  13.36,26.77 180 top
Q4  59.05,29.21 180 top
Q5  52.98,24.71 180 top
Q6  45.36,24.69 180 top
Q7  66.67,26.03 180 top
Q8  49.23,24.71 180 top
Q9  76.28,8.46 90 top
Q11  13.34,31.11 180 top
Q12  22.17,25.83 90 top
R1  62.87,29.21 180 top
R2  59.05,32.38 0 top
R3  15.88,24.77 180 top
R4  66.67,22.86 180 top
R5  52.98,27.69 0 top
R6  45.36,27.74 0 top
R7  59.05,26.03 0 top
R8  50.06,21.13 0 top
R9  66.67,29.21 0 top
R10  62.87,22.86 0 top
R11  33.58,5.21 90 top
R12  46.25,21.13 0 top
R13  49.23,27.69 180 top
R14  53.49,21.13 180 top
R15  42.47,3.58 270 top
R16  76.99,17.58 180 top
R17  12.06,5.21 270 top
R18  77.37,3.76 90 top
R19  16.51,27.94 90 top
R20  22.61,15.72 270 top
R21  16.51,31.75 90 top
R22  15.01,39.98 90 top
R23  116.71,5.41 270 top  (outside the outline)
R24  123.11,6.02 270 top  (outside the outline)
R25  40.89,17.53 0 top
R26  8.89,33.65 180 top
R27  8.89,31.11 180 top
R28  9.53,28.57 0 top
R29  20.5,14.86 270 top
R30  27.2,25.91 90 top
R34  2.64,23.85 180 top
R35  6.07,23.83 180 top
R38  66.7,33.76 90 top
RGB_LED  3.81,30.48 270 top
SJ2  106.93,12.32 180 bottom  (outside the outline)
SJ3  20.32,34.29 90 bottom
SJ4  23.5,34.29 90 bottom
STM32F103CB  32.44,20.07 0 top
SUPPLY_IN  5.08,18.41 270 top
SUPPLY_IN1  5.08,10.79 270 top
SW1  38.15,6.05 0 top
U1  44.63,31.98 270 top
U2  10.79,11.71 0 top
U5  57.94,13.16 90 top
U$1  -2.54,-48.9 0 top  (outside the outline)
U$2  -10.79,-92.71 0 top  (outside the outline)
U$10  23.5,6.98 0 top

### Tracks (layer width: path | path; a pad name or v marks a point on that pad's centre or on a via)
+3V3  (via drill 0.35)  (16 unrouted)
  Top 0.305: U1.8 42.15,32.73 41.22,33.65 C1.1 | STM32F103CB.36 39.16,22.82 C39.1 | R25.2 v42.85,17.53 | STM32F103CB.24 35.19,14.6 v35.71,14.07 | STM32F103CB.9 26.89,18.82 v26.49,18.41 | STM32F103CB.1 27.99,23.63 | 27.99,23.63 v27.96,23.65 | 27.99,23.63 28.88,24.52 STM32F103CB.48 29.69,28.38 C40.1
  Top 0.406: U5.8 56.96,16.45 57.48,16.97 v58.88,16.97 | U2.4 11.77,9.82 12.06,9.53 12.7,9.53 v13.34,10.16 | R29.1 21.36,16.57 | 21.36,16.57 R20.1 24.49,16.57 C33.1 | 21.36,16.57 21.36,16.89 20.19,18.06 v15.01,18.06
  Top 0.813: C7.1 15.01,16.91 v15.01,18.06
  Top 1.016: IC1.2 13.15,19.37 C5.1 | C7.1 C4.1
  Top 1.27: C5.1 C4.1
  Top 1.524: C20.1 38.26,29.69 C18.1 C1.1
+5V  (6 unrouted)
  Top 0.305: 52.03,25.54 Q5.2
  Top 0.406: R12.2 47.1,23.61 48.18,24.69 50.8,24.69 | 52.03,25.54 51.19,24.69 50.8,24.69 | R8.2 50.91,24.57 50.8,24.69 | C34.+ 19.05,36.25 19.05,39.12 | 19.05,39.12 PI_HEADER.38 | 19.05,39.12 17.83,40.34 PI_HEADER.40 | R4.2 64.77,23.91 64.77,24.77 64.14,25.4 | 64.14,25.4 63.5,26.03 62.87,26.03 61.91,26.98 Q2.2 60.81,26.03 R7.2 | 64.14,25.4 64.77,26.03 68.58,26.03 69.34,25.27 C14.+
  Top 0.508: Q1.3 9.53,27.32 9.81,27.61 11.14,27.61 11.38,27.37 11.38,26.72 12.43,25.67 Q3.3 13.34,25.7 Q11.3
  Top 0.61: IC3.20 56.21,18.9 C6.+ | 69.72,20.32 69.72,19.18 70,18.9 IC2.20 74.92,18.9 75.1,19.08
  Top 0.813: C6.+ 56.44,19.13 C9.1 | C2.1 69.77,29.16 C14.+ 69.72,25.22 C11.1 69.72,20.32 | Q9.3 75.18,10.4 74.73,10.85 74.73,18.7 75.1,19.08 LDIAR.P5
+8V  (5 unrouted)
  Top 0.406: R17.1 11.68,7.62 10.79,7.62 10.79,9.17 10.47,9.49 U2.2
  Top 0.61: IC2.10 60.81,7.47 60.33,6.98 60.33,4.09 59.08,2.84 C12.+ | IC3.10 43.33,7.47 41.91,8.89 41.91,10.79 40.64,12.06 C3.+
  Top 0.813: LIDAR.P1 76.7,39.73 C10.+ 72.7,39.57 D1.C
  Top 1.016: C43.+ 10.09,35.84 8.89,37.04 D3.C 7.94,38.29 FAN.P1 | IC1.1 13.15,21.27 C8.1
  Top 1.27: 1.65,34.29 2.92,35.56 7.41,35.56 8.89,37.04
  Top 1.778: U$10.IN+ 15.75,7.11 14.85,8.01 R17.1
BAT_LVL
  Top 1.016: R34.1 5.2,23.85 R35.2
BOOT0  (via drill 0.35)  (2 unrouted)
  Top 0.305: STM32F103CB.44 31.69,25.42 v31.27,25.84
BOOT1
  Top 0.305: STM32F103CB.20 33.19,6.45 R11.2 36.88,2.75 SW1.1
GND  (via drill 0.35)  (44 unrouted)
  Top 0.305: 40.69,29.16 C21.2 41.96,30.4 41.96,30.98 42.2,31.23 U1.11 | U1.18 45.88,29.69 46.35,29.21 47.96,29.21 C17.2 | v34.72,13.89 34.69,13.93 STM32F103CB.23 34.69,16.75 31.11,20.32 | STM32F103CB.47 30.19,23.15 31.02,22.32 31.75,22.32 | 31.75,22.32 STM32F103CB.35 | STM32F103CB.8 30.11,19.32 31.11,20.32 | 31.11,20.32 31.75,20.95 31.75,22.32
  Top 0.406: Q8.2 47.12,24.66 45.54,24.66 Q6.2 | IC3.15 58.6,12.55 58.91,12.23 U5.4 58.91,10.2 59.35,9.77 | U2.8 9.82,12.06 10.16,11.72 10.49,11.72 | U2.7 10.47,11.74 10.49,11.72 | 10.49,11.72 11.12,11.72 | 11.12,11.72 15.71,11.72 U$10.IN- | U2.3 11.12,11.71 11.12,11.72 | R10.1 61.99,22.84 | Q7.2 64.92,27.94 v64.85,27.94
  Top 0.61: IC3.6 IC3.7 53.85,11.28 54,11.43 | IC3.6 IC3.5 | IC3.5 IC3.4 IC3.17 | IC3.14 54,11.43 | 54,11.43 IC3.15 | IC3.15 IC3.16 | IC3.17 IC3.16 | IC3.15 IC3.6 | IC3.5 IC3.16 | IC2.7 IC2.14 IC2.15 | IC2.6 IC2.15 | IC2.5 IC2.16 | IC2.7 IC2.6 | IC2.6 IC2.5 | IC2.5 IC2.4 IC2.17 IC2.16 | IC2.16 IC2.15 | C6.- 59.05,19.05 57.78,17.78 57.15,17.78 55.88,16.51 55.88,15.87 55.09,15.09 IC3.17 | IC2.7 60.86,11.28 59.35,9.77 59.08,9.5 C12.- | LDIAR.P4 72.72,22.77 72.62,22.86 | C34.- 18.82,33.89 16.87,35.84 C43.-
  Top 0.813: C9.2 59.24,19.08 C6.- | IRLML1.2 69.56,33.72 69.56,34.28 69.57,34.29 69.57,39.6 C10.- | C2.2 72.52,25.37 C14.- 72.62,22.86 72.62,21.06 C11.2
  Top 1.016: C43.- 13.34,37.06 IRLML2502.2 | SUPPLY_IN1.1 4.45,8.36 C27.- | SUPPLY_IN.1 6.92,18.46 R35.1 6.92,26.1 5.52,27.5 RGB_LED.P1
  Top 1.27: C4.2 C5.2
  Top 1.524: C1.2 C18.2 C20.2
  Top 1.778: SUPPLY_IN.1 7.21,14.48 7.21,11.13 SUPPLY_IN1.1 8.26,5.82 C16.2
LIDAR_POS_INT  (via drill 0.35)  (1 unrouted)
  Top 0.305: STM32F103CB.25 v38.25,17.32
M_DIR_1  (via drill 0.35)  (1 unrouted)
  Top 0.305: STM32F103CB.15 30.69,14.43 v29.92,13.67
  Top 0.406: 64.77,29.21 v64.77,30.48
  Top 0.813: R1.1 64.77,29.21 R9.1
M_DIR_2  (via drill 0.35)  (1 unrouted)
  Top 0.305: STM32F103CB.17 31.69,13.63 v31.9,13.41
  Top 0.406: 51.44,27.69 51.21,27.91 v51.21,28.85
  Top 0.61: R13.1 51.44,27.69 R5.1
N$1  (via drill 0.35)
  Top 0.406: Q7.3 67.53,24.09 R4.1 67.53,20.1 v67.94,19.69
  Top 0.61: IC2.9 IC2.12 72.72,8.74 73.25,9.27 v73.25,17.86
  Bottom 0.406: v67.94,19.69 69.77,17.86 v73.25,17.86
N$2  (via drill 0.35)
  Top 0.813: IC3.18 v49.38,16.36
  Bottom 0.813: v49.38,16.36 49.38,6.5 50.8,5.08 52.07,5.08 52.41,4.73 ML2.P2
N$3  (via drill 0.35)
  Top 0.813: IC3.13 v50.7,10.01
  Bottom 0.813: ML2.P1 54.41,4.79 52.68,6.53 51.4,6.53 50.7,7.23 v50.7,10.01
N$4  (via drill 0.35)
  Top 0.813: IC2.18 v68.15,16.36
  Bottom 0.813: v68.15,16.36 68.15,8.05 70.83,5.37 MR2.P2
N$5
  Top 0.406: Q2.3 63.66,24.14 R10.2 65.41,21.17 65.41,17.63
  Top 0.61: IC2.19 67.31,17.63 65.41,17.63 IC2.2
N$6  (via drill 0.35)
  Top 0.406: Q8.3 49.21,23.6 R8.1 48.27,20.19 v48.21,20.19
  Top 0.61: IC3.9 IC3.12 v55.96,8.74
  Bottom 0.406: v48.21,20.19 52.2,20.19 52.7,19.69 52.7,11.99 v55.96,8.74
N$7
  Top 0.406: R14.2 52.64,22.16 52.98,22.5 Q5.3 | 52.55,21.04 R14.2 | R14.2 52.64,20.89 52.07,20.32 52.07,17.63
  Top 0.61: IC3.2 52.07,17.63 IC3.19
N$8  (via drill 0.35)
  Top 0.406: R7.1 59.48,24.77 60.33,24.77 60.96,24.13 60.96,18.87 60.98,18.85 61.04,18.9 62.23,18.9
  Top 0.61: IC2.1 62.23,18.9 v64.14,18.9 | IC2.11 v64.14,7.47 | R7.1 59.05,26.88 Q4.3
  Bottom 0.61: v64.14,18.9 v64.14,7.47
N$9  (via drill 0.35)
  Top 0.406: Q6.3 45.36,21.17 R12.1 45.4,18.91 45.41,18.9
  Top 0.61: IC3.1 45.41,18.9 v50.7,18.9 | IC3.11 v51.79,7.47
  Bottom 0.61: v50.7,18.9 51.79,17.8 v51.79,7.47
N$10
  Top 0.406: R1.2 63.72,27.51 63.72,27.23
  Top 0.61: 63.72,27.23 Q2.1
N$11
  Top 0.406: R2.2 59.91,30.41
  Top 0.61: Q4.1 59.91,30.41
N$12
  Top 0.406: R9.2 67.62,29.11 67.62,27.36
  Top 0.61: 67.62,27.36 Q7.1
N$13
  Top 0.61: Q5.1 53.93,27.59 R5.2
N$14
  Top 0.61: R6.2 46.21,25.89 Q6.1
N$15
  Top 0.61: Q8.1 48.38,27.61 R13.2
N$16  (via drill 0.35)
  Top 0.813: IC2.13 v69.39,10.01
  Bottom 0.813: MR2.P1 72.83,5.27 69.39,8.71 v69.39,10.01
N$17  (via drill 0.35)
  Top 0.813: IC2.8 v65.63,10.01
  Bottom 0.813: v65.63,10.01 65.63,7.21 63.84,5.42 MR1.P2
N$18  (via drill 0.35)
  Top 0.61: 66.9,16.36 v66.93,16.38
  Top 0.813: IC2.3 66.9,16.36
  Bottom 0.813: v66.93,16.38 66.93,6.6 65.84,5.52 MR1.P1
N$19
  Top 0.813: Q9.1 R18.2
N$20
  Top 0.813: Q9.2 78.89,10.92 78.89,16.52 R16.1
N$21
  Top 0.813: R16.2 76.78,16.94 76.78,16.8 76.79,16.79 FRONTLIGHT.P1
N$22
  Top 0.508: R3.2 14.23,24.77 14.03,24.56 12.41,24.56 Q1.1
N$23
  Top 0.508: R19.2 15.23,28.79 Q3.1
N$24
  Top 0.508: Q1.2 8.57,28.47 R28.1
N$25  (via drill 0.35)
  Top 0.813: IC3.8 v47.02,10.01
  Bottom 0.813: v47.02,10.01 45.43,8.42 ML1.P2
N$26  (via drill 0.35)
  Top 0.813: IC3.3 v48.11,16.36
  Bottom 0.813: ML1.P1 47.43,5.85 48.11,6.53 v48.11,16.36
N$28
  Top 0.508: Q3.2 12.41,28.57 | 12.41,28.57 12.41,28.86 | 12.41,28.57 9.87,31.11 R27.1
N$30
  Top 0.508: Q11.2 10.95,33.65 R26.1
N$31
  Top 0.508: R26.2 4.01,33.65 RGB_LED.P4
N$32
  Top 0.508: R21.2 14.67,32.6 Q11.1
N$33
  Top 0.508: RGB_LED.P3 4.24,31.11 R27.2
N$34
  Top 0.305: U1.20 47.1,31.23 48.67,32.79 C17.1
N$35
  Top 0.508: RGB_LED.P2 7.34,29.5 7.37,29.53 9.42,29.53 R28.2
N$36
  Top 0.305: C21.1 41.02,31.73 U1.10
N$37
  Top 0.508: IRLML2502.3 12.42,40.13 14.31,40.13 R22.2
N$38
  Top 0.813: R38.2 68.52,34.61 IRLML1.3
N$39
  Top 0.813: LIDAR.P2 76.8,37.79 D1.A 74.97,31.75 71.75,31.75 70.56,32.94 IRLML1.1
N$41  (5 unrouted)
N$42  (2 unrouted)
N$43  (2 unrouted)
N$44  (1 unrouted)
N$45  (1 unrouted)
N$46
  Top 0.305: STM32F103CB.6 23.43,20.32 23.42,20.32
  Top 0.406: C36.2 23.42,20.32 Q12.1
N$47
  Top 0.305: 24.29,31.28 C37.2 24.82,22.81 26.81,20.82 STM32F103CB.5
  Top 0.406: Q12.3 20.92,29.18 23.02,31.28 24.29,31.28
N$49
  Top 0.305: STM32F103CB.2 26.93,22.32 26.47,22.78 26.47,24.32 R30.1
N$55
  Top 1.016: IRLML2502.1 8.95,41.15 D3.A 8.89,41.09 8.1,40.29 FAN.P2
NRST  (via drill 0.35)  (1 unrouted)
  Top 0.305: STM32F103CB.7 25.99,19.82 v25.6,19.43
PWM_FAN  (via drill 0.35)
  Top 0.406: R22.1 15.88,38.27 v15.88,38.1
PWM_LIDAR  (via drill 0.35)
  Top 0.406: R38.1 66.59,33.02 v64.77,33.02
PWM_M_EN_1  (via drill 0.35)  (1 unrouted)
  Top 0.305: STM32F103CB.16 31.19,13.79 v30.89,13.49
  Top 0.406: R2.1 v56.52,32.38
PWM_M_EN_2  (via drill 0.35)  (1 unrouted)
  Top 0.305: STM32F103CB.18 32.19,14.47 v32.49,14.17
  Top 0.406: R6.1 43.2,27.74 v43.18,27.76
SCL  (via drill 0.35)  (2 unrouted)
  Top 0.305: STM32F103CB.42 32.69,25.42 v33.25,25.98
  Top 0.406: U2.5 11.77,13.67 12.06,13.97 20.46,13.97 R29.2 21.17,13.33 v21.64,13.33
SDA  (via drill 0.35)  (2 unrouted)
  Top 0.305: STM32F103CB.43 v32.19,26.33 v32.19,26.34 | R20.2 19.32,14.87 19.05,14.6
  Top 0.406: U2.6 11.12,13.81 11.83,14.53 18.97,14.53 19.05,14.6 | R20.2 v22.61,13.69
SWDCLK  (via drill 0.35)
  Top 0.305: STM32F103CB.37 v35.19,25.88 v35.18,25.88
SWDIO  (via drill 0.35)  (1 unrouted)
  Top 0.305: STM32F103CB.34 38.11,21.82 v38.43,22.13
TEMPERATURE  (via drill 0.35)  (1 unrouted)
  Top 0.305: R25.1 38.76,18.81 v38.6,18.81 v38.6,18.82 STM32F103CB.28
  Top 0.406: U5.1 56.96,9.51 v56.97,9.5
U1_RX  (via drill 0.35)  (1 unrouted)
  Top 0.305: STM32F103CB.31 39.69,20.32 v39.88,20.12
U1_TX  (via drill 0.35)  (1 unrouted)
  Top 0.305: STM32F103CB.30 38.88,19.82 v39.06,19.63
USART2_RX  (via drill 0.35)  (1 unrouted)
  Top 0.305: STM32F103CB.13 29.69,14.78 v29.21,14.3
USART2_TX  (via drill 0.35)  (1 unrouted)
  Top 0.305: STM32F103CB.12 26.97,17.32 v26.57,16.92
USB_DM  (via drill 0.35)
  Top 0.305: STM32F103CB.32 39.68,20.82 v39.9,21.03
USB_DP  (via drill 0.35)
  Top 0.305: STM32F103CB.33 38.9,21.32 v39.3,21.71
V+
  Top 0.406: U2.1 9.82,2.71 9.53,2.41
  Top 0.813: 4.65,20.12 SUPPLY_IN.2
  Top 1.016: R34.2 1.79,23.4 SUPPLY_IN.2
  Top 1.778: SUPPLY_IN.2 2.54,17.57 2.54,15.03 SUPPLY_IN1.2 1.91,9.32 1.91,3.17 2.69,2.38 C27.+ 4.47,2.41 C16.1 9.53,2.41 R17.2
(copper drawn outside any net)
  shapes: Top area x8